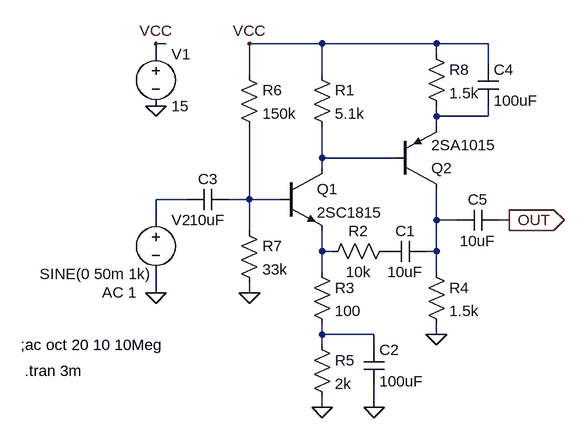
[diagram p0: schematic NegativeFeedBack.asc]
NegativeFeedBack.asc, the LTspice schematic file:
Version 4
SHEET 1 880 680
WIRE -48 -80 -64 -80
WIRE 192 -80 80 -80
WIRE 368 -80 192 -80
WIRE 448 -80 368 -80
WIRE -64 -64 -64 -80
WIRE 368 -64 368 -80
WIRE 448 -48 448 -80
WIRE 80 -32 80 -80
WIRE 192 -32 192 -80
WIRE 368 32 368 16
WIRE 448 32 448 16
WIRE 448 32 368 32
WIRE 368 48 368 32
WIRE 192 96 192 48
WIRE 304 96 192 96
WIRE 192 112 192 96
WIRE -16 160 -64 160
WIRE 80 160 80 48
WIRE 80 160 48 160
WIRE 128 160 80 160
WIRE -64 192 -64 160
WIRE 368 192 368 144
WIRE 400 192 368 192
WIRE 480 192 464 192
WIRE 80 208 80 160
WIRE 192 240 192 208
WIRE 208 240 192 240
WIRE 368 240 368 192
WIRE 368 240 352 240
WIRE 192 272 192 240
WIRE 368 272 368 240
WIRE -64 304 -64 272
WIRE 80 304 80 288
WIRE 192 368 192 352
WIRE 272 368 192 368
WIRE 368 368 368 352
WIRE 192 384 192 368
WIRE 272 384 272 368
WIRE 192 480 192 464
WIRE 272 480 272 448
FLAG 272 480 0
FLAG 192 480 0
FLAG 80 304 0
FLAG 368 368 0
FLAG 480 192 OUT
IOPIN 480 192 Out
FLAG -64 -80 VCC
FLAG -64 16 0
FLAG 80 -80 VCC
FLAG -64 304 0
SYMBOL npn 128 112 R0
SYMATTR InstName Q1
SYMATTR Value 2SC1815
SYMBOL pnp 304 144 M180
SYMATTR InstName Q2
SYMATTR Value 2SA1015
SYMBOL res 176 -48 R0
SYMATTR InstName R1
SYMATTR Value 5.1k
SYMBOL res 304 224 R90
WINDOW 0 0 56 VBottom 2
WINDOW 3 32 56 VTop 2
SYMATTR InstName R2
SYMATTR Value 10k
SYMBOL cap 352 224 R90
WINDOW 0 0 32 VBottom 2
WINDOW 3 32 32 VTop 2
SYMATTR InstName C1
SYMATTR Value 10uF
SYMBOL res 176 256 R0
SYMATTR InstName R3
SYMATTR Value 100
SYMBOL res 352 256 R0
SYMATTR InstName R4
SYMATTR Value 1.5k
SYMBOL res 176 368 R0
SYMATTR InstName R5
SYMATTR Value 2k
SYMBOL cap 256 384 R0
SYMATTR InstName C2
SYMATTR Value 100uF
SYMBOL res 64 -48 R0
SYMATTR InstName R6
SYMATTR Value 150k
SYMBOL res 64 192 R0
SYMATTR InstName R7
SYMATTR Value 33k
SYMBOL cap 48 144 R90
WINDOW 0 0 32 VBottom 2
WINDOW 3 32 32 VTop 2
SYMATTR InstName C3
SYMATTR Value 10uF
SYMBOL res 352 -80 R0
SYMATTR InstName R8
SYMATTR Value 1.5k
SYMBOL cap 432 -48 R0
SYMATTR InstName C4
SYMATTR Value 100uF
SYMBOL cap 464 176 R90
WINDOW 0 0 32 VBottom 2
WINDOW 3 32 32 VTop 2
SYMATTR InstName C5
SYMATTR Value 10uF
SYMBOL voltage -64 -80 R0
WINDOW 123 0 0 Left 2
WINDOW 39 0 0 Left 2
SYMATTR InstName V1
SYMATTR Value 15
SYMBOL voltage -64 176 R0
WINDOW 3 -179 99 Left 2
WINDOW 123 -83 127 Left 2
WINDOW 39 -134 132 Left 2
SYMATTR InstName V2
SYMATTR Value SINE(0 50m 1k)
SYMATTR Value2 AC 1
TEXT -266 424 Left 2 !.tran 3m
TEXT -272 384 Left 2 !;ac oct 20 10 10Meg

The netlist it stands for:
* NegativeFeedBack.asc
Q1 N002 N004 N006 0 2SC1815
Q2 N005 N002 N001 0 2SA1015
R1 VCC N002 5.1k
R2 P001 N006 10k
C1 N005 P001 10uF
R3 N006 N007 100
R4 N005 0 1.5k
R5 N007 0 2k
C2 N007 0 100uF
R6 VCC N004 150k
R7 N004 0 33k
C3 N004 N003 10uF
R8 VCC N001 1.5k
C4 VCC N001 100uF
C5 OUT N005 10uF
V1 VCC 0 15
V2 N003 0 SINE(0 50m 1k) AC 1
.model NPN NPN
.model PNP PNP
.lib standard.bjt
.tran 3m
;ac oct 20 10 10Meg
.backanno
.end